# EAGLE design MS5803-14BA_Breakout_v10 (EAGLE 9.5.0)
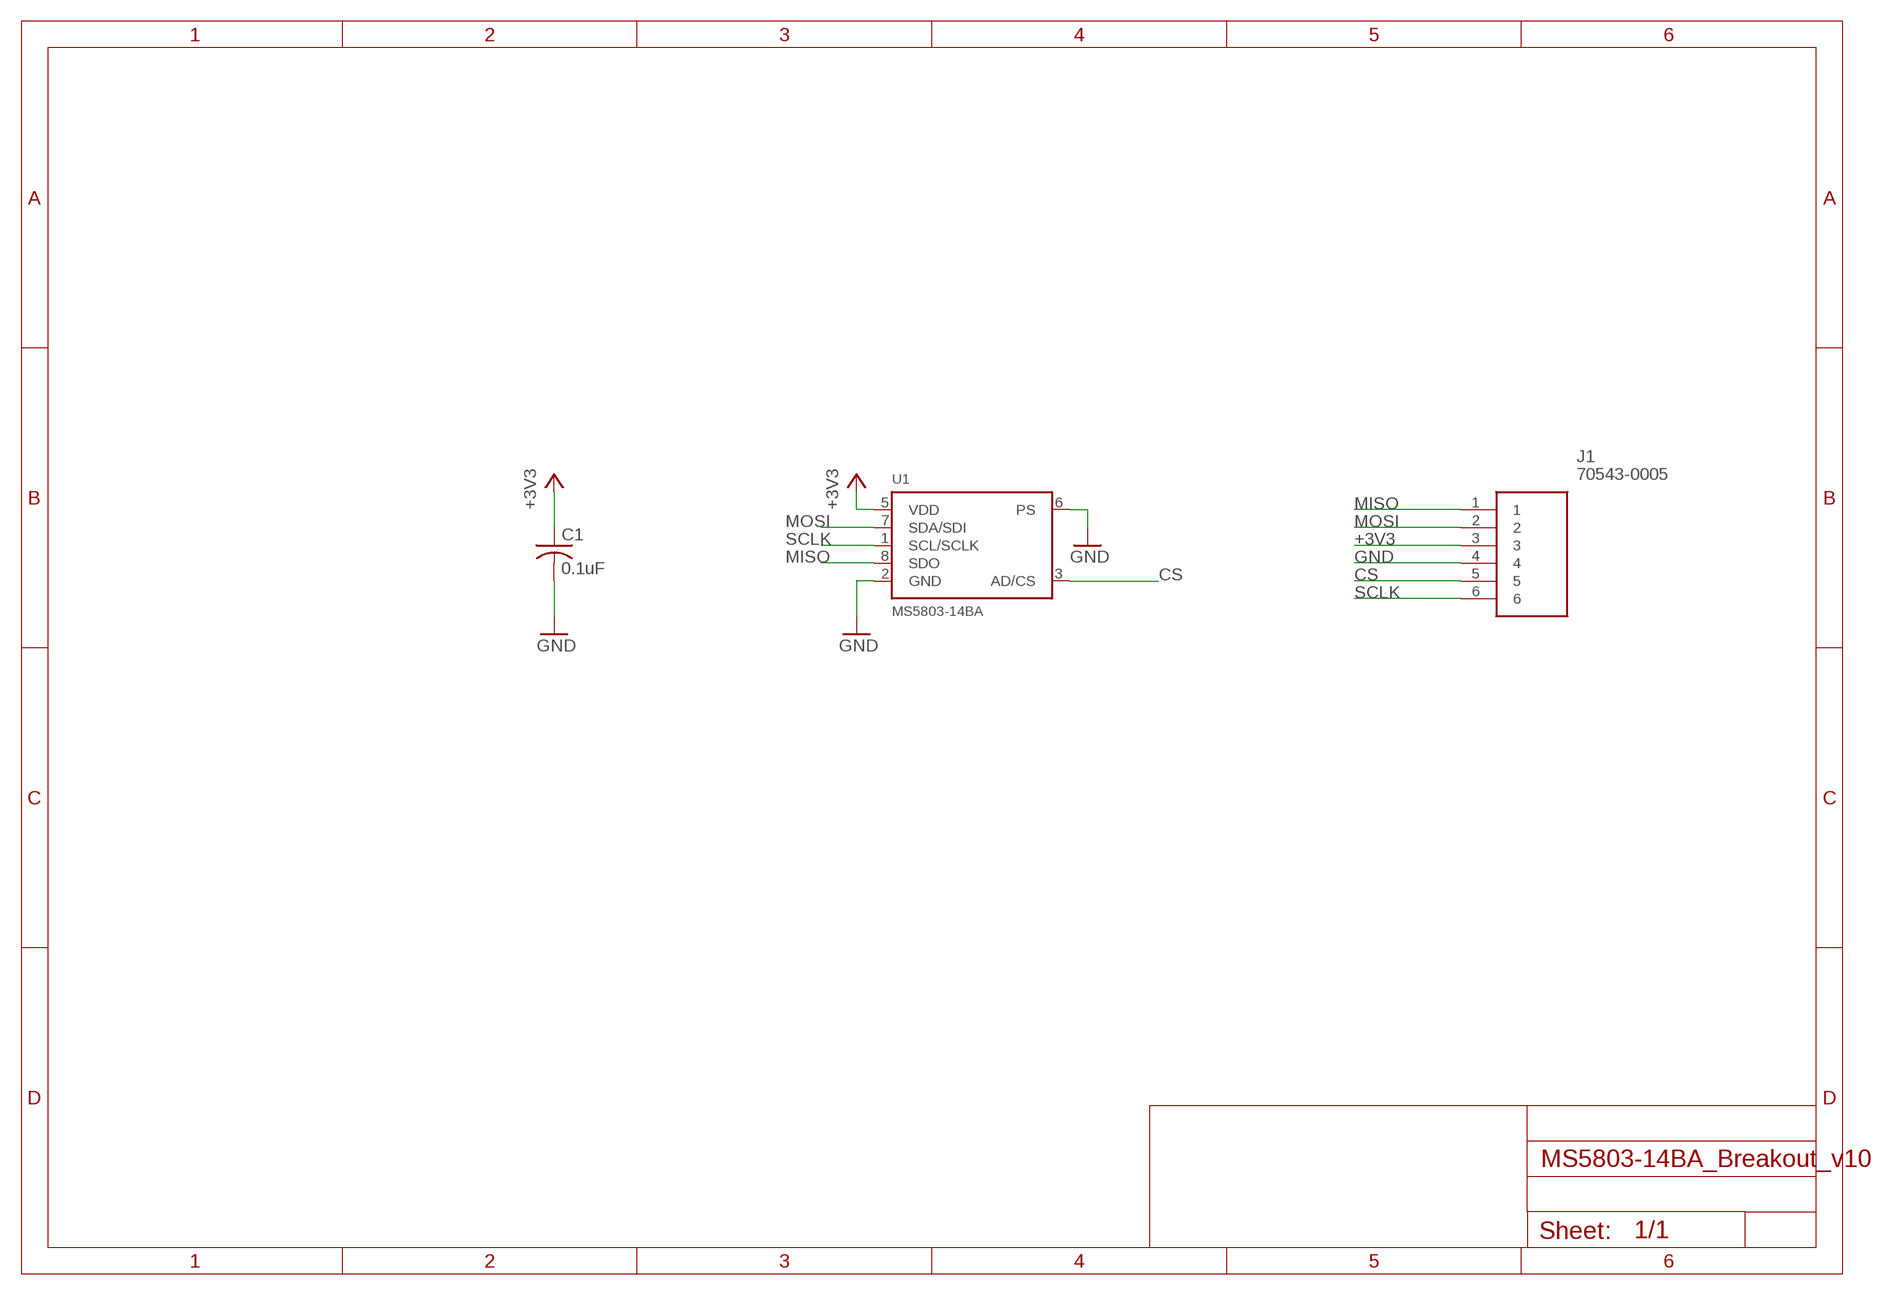
[diagram p0: schematic, sheet 1]

## Parts
C1  0.1uF  C-USC1206  [C1206]
J1  70543-0005  [SHDR6W117P0X254_1X6_1779X508X1]
U1  MS5803-14BA  [MS5803]

## Nets
+3V3: C1.1 J1.3 U1.5(VDD)
CS: J1.5 U1.3(AD/CS)
GND: C1.2 J1.4 U1.2(GND) U1.6(PS)
MISO: J1.1 U1.8(SDO)
MOSI: J1.2 U1.7(SDA/SDI)
SCLK: J1.6 U1.1(SCL/SCLK)

## Library data of the parts
C1 = rcl:C-US: CAPACITOR, American symbol; SPICEPREFIX: C
J1 = SamacSys_Parts:70543-0005: Molex SL Series, Series Number 70543, 2.54mm Pitch 6 Way 1 Row Straight PCB Header, Solder Termination, 3A Source: Datasheet <https://componentsearchengine.com/Datasheets/1/70543-0005.pdf>; DESCRIPTION: Molex SL Series, Series Number 70543, 2.54mm Pitch 6 Way 1 Row Straight PCB Header, Solder Termination, 3A; HEIGHT: 11.3mm; MANUFACTURER_NAME: Molex; MANUFACTURER_PART_NUMBER: 70543-0005; MOUSER_PART_NUMBER: 538-70543-0005; MOUSER_PRICE-STOCK: https://www.mouser.com/Search/Refine.aspx?Keyword=538-70543-0005
U1 = MS5803:MS5803-14BA; PROD_ID: IC-12111

## Board
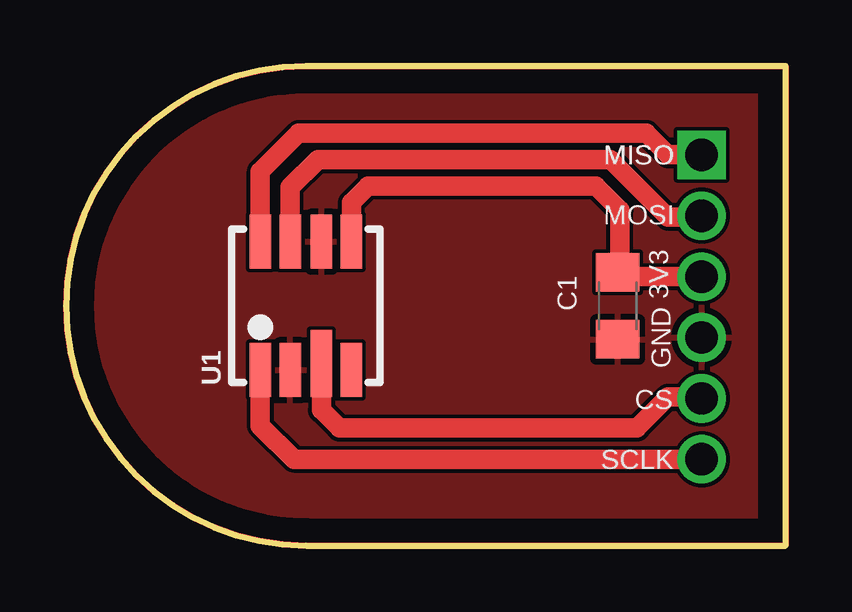
[diagram p1: board, top side]
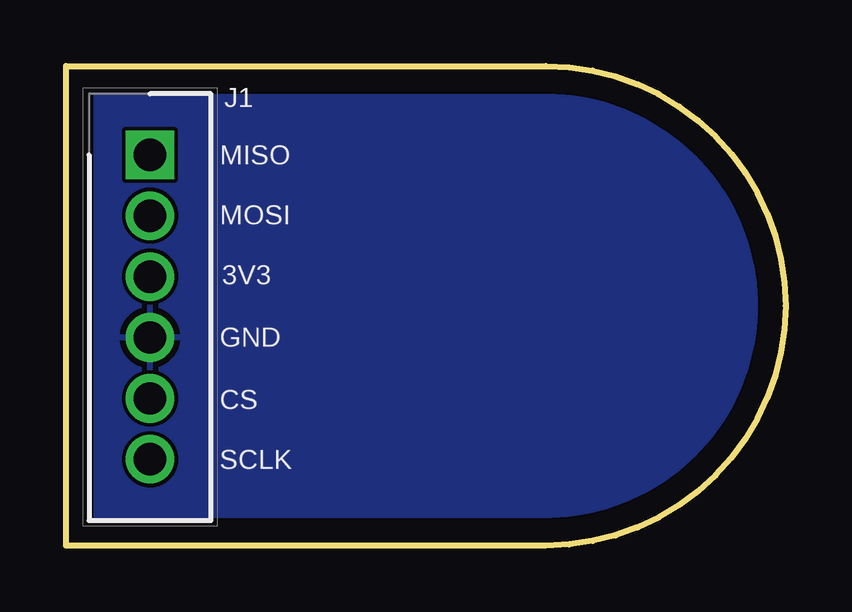
[diagram p2: board, bottom side, seen from below]

Size 30 x 20 mm. Coordinates in mm from the lower left corner, seen from the top.
Outline: 10,20 arc180 10,0 30,0 30,20 10,20
Copper layers (1*16): Top 0.035mm / dielectric 1.5mm / Bottom 0.035mm
Design rules "default": minimum track width 6mil, minimum drill 0.35mm, track to track 6mil, track to pad 6mil, pad to pad 6mil, via to via 6mil, smd to smd 6mil, copper to edge 40mil, drill to drill 6mil, minimum pad ring 10mil, minimum via ring 8mil, stop-mask expansion 4mil, vias tented up to drill 0mil, thermal gap 10mil

### Footprints (pad centres in the part's own frame; a part is rotated, then mirrored left to right if it is on the bottom)
C1206 = smd 1.6 x 1.8: 1 -1.4,0; 2 1.4,0
SHDR6W117P0X254_1X6_1779X508X1 = drill 1.35 pad 2.025 square: 1 0,0 | drill 1.35 pad 2.025: 2 2.54,0; 3 5.08,0; 4 7.62,0; 5 10.16,0; 6 12.7,0
MS5803 = smd 2.25 x 0.9: 1 -2.675,1.9; 2 -2.675,0.65; 4 -2.675,-1.9; 5 2.675,-1.9; 6 2.675,-0.65; 7 2.675,0.65; 8 2.675,1.9 | smd 2.8 x 0.9: 3 -2.4,-0.65

### Placement (x,y rotation side)
C1  23,10 270 top
J1  26.5,16.3 270 bottom
U1  10,10 90 top

### Tracks (layer width: path | path; a pad name or v marks a point on that pad's centre or on a via)
+3V3
  Top 0.813: U1.5 11.9,14.3 12.6,15 22.1,15 23.1,14 23.1,11.5 C1.1 23.08,11.22 J1.3
CS
  Top 0.813: U1.3 10.65,5.65 11.4,4.9 23.8,4.9 25.1,6.2 26.44,6.2 J1.5
GND
  Top 0.254: 30,0 10,0 arc-180 10,20 30,20 30,0
  pour Top: 30,0 10,0 arc-180 10,20 30,20
  pour Bottom: 10,20 arc180 10,0 30,0 30,20
MISO
  Top 0.813: U1.8 8.1,15.6 9.7,17.2 24.2,17.2 25.1,16.3 J1.1
MOSI
  Top 0.813: U1.7 9.35,14.95 10.5,16.1 22.7,16.1 25.1,13.7 26.44,13.7 J1.2
SCLK
  Top 0.813: U1.1 8.1,5 9.5,3.6 J1.6

### Text on the board
tNames: MISO | MISO | MOSI | 3V3 | GND | CS | SCLK
bNames: MISO | MOSI | 3V3 | GND | CS | SCLK